# EasyEDA schematic ESP8266_Stepper_Driver_easyeda.json
TITLE: ESP8266 - Stepper Driver; REV: 1.0; Date: 2022-01-17; Sheet: 1/1; Company: Lrocket
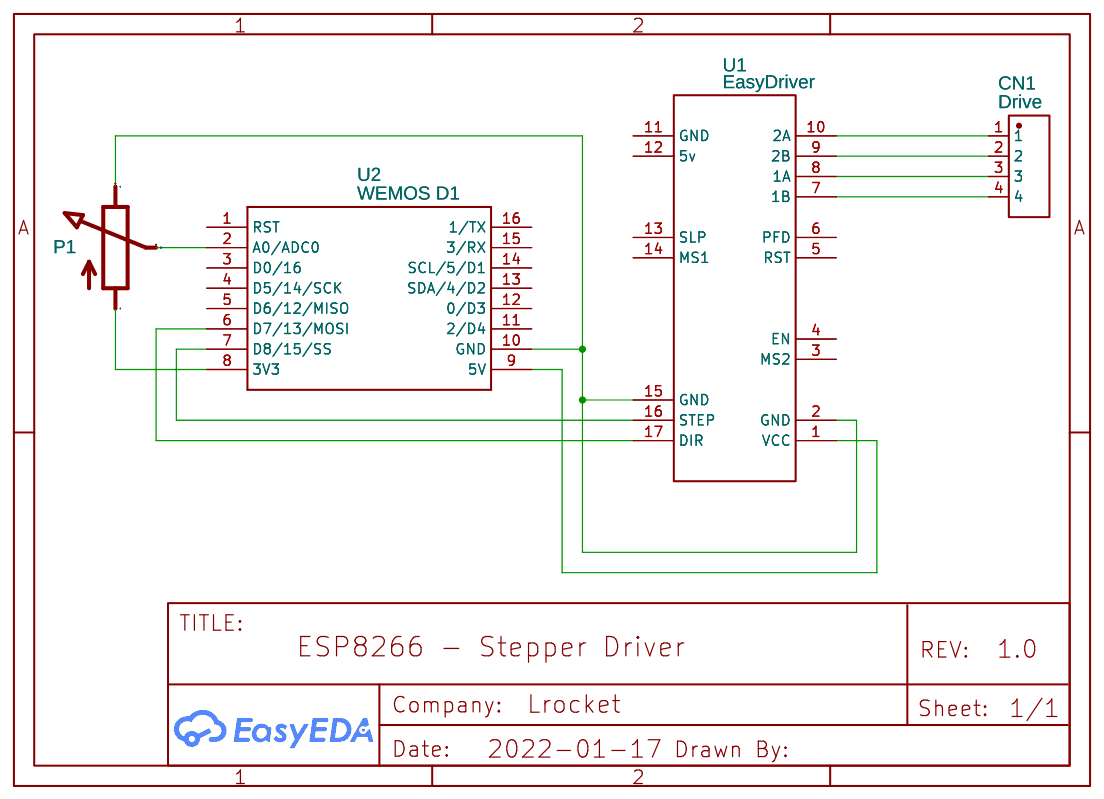
[diagram p0: schematic sheet]

## Parts
CN1  Drive  [CONN-TH_4P-P4.00_FLY4-HEADER4]
P1  Poti  [3PIN]
U1  EasyDriver  [EASYDRIVER]
U2  WEMOS D1  [WEMOS_D1_MINI_BOARD]

## Library data of the parts
CN1 = FLY4-HEADER4: Supplier: LCSC; Supplier Part: C9900006105; Manufacturer Part: FLY4-Header4; JLCPCB Part Class: Extended Part; Contributor: LCSC
P1 = POTI_MONO_XL
U1 = EasyDriver: link: https://www.schmalzhaus.com/EasyDriver/; Contributor: lwweb
U2 = WEMOS D1: sourceId: YemgaslDx

## Nets
Net-(CN1-1): CN1.1 U1.10(2A)
Net-(CN1-2): CN1.2 U1.9(2B)
Net-(CN1-3): CN1.3 U1.8(1A)
Net-(CN1-4): CN1.4 U1.7(1B)
Net-(P1-1): P1.1(A) U2.8(3V3)
Net-(P1-2): P1.2(E) U1.2(GND) U1.15(GND) U2.10(GND)
Net-(P1-3): P1.3(S) U2.2(A0/ADC0)
Net-(U1-1): U1.1(VCC) U2.9(5V)
Net-(U1-16): U1.16(STEP) U2.7(D8/15/SS)
Net-(U1-17): U1.17(DIR) U2.6(D7/13/MOSI)

Not connected (* = marked no-connect by the designer): U1 3(MS2) 4(EN) 5(RST) 6(PFD) 11(GND) 12(5v) 13(SLP) 14(MS1); U2 1(RST) 3(D0/16) 4(D5/14/SCK) 5(D6/12/MISO) 11(2/D4) 12(0/D3) 13(SDA/4/D2) 14(SCL/5/D1) 15(3/RX) 16(1/TX)
